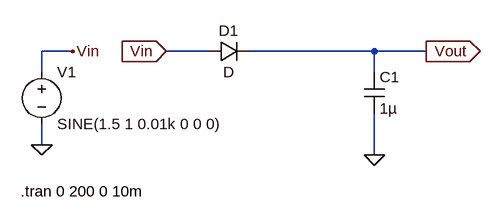
[diagram p0: schematic Diode cap series.asc]
Diode cap series.asc, the LTspice schematic file:
Version 4
SHEET 1 880 680
WIRE -160 48 -208 48
WIRE 48 48 -16 48
WIRE 304 48 112 48
WIRE 384 48 304 48
WIRE -208 80 -208 48
WIRE 304 80 304 48
WIRE -208 192 -208 160
WIRE 304 208 304 144
FLAG 304 208 0
FLAG 384 48 Vout
IOPIN 384 48 Out
FLAG -16 48 Vin
IOPIN -16 48 In
FLAG -208 192 0
FLAG -160 48 Vin
SYMBOL diode 48 64 R270
WINDOW 0 32 32 VTop 2
WINDOW 3 0 32 VBottom 2
SYMATTR InstName D1
SYMBOL cap 288 80 R0
SYMATTR InstName C1
SYMATTR Value 1µ
SYMBOL voltage -208 64 R0
WINDOW 123 0 0 Left 0
WINDOW 39 0 0 Left 0
SYMATTR InstName V1
SYMATTR Value SINE(1.5 1 0.01k 0 0 0)
TEXT -240 264 Left 2 !.tran 0 200 0 10m

The netlist it stands for:
* Diode cap series.asc
D1 Vin Vout D
C1 Vout 0 1µ
V1 Vin 0 SINE(1.5 1 0.01k 0 0 0)
.model D D
.lib standard.dio
.tran 0 200 0 10m
.backanno
.end